# EAGLE design can-bus_trancseiver (EAGLE 7.6.0)
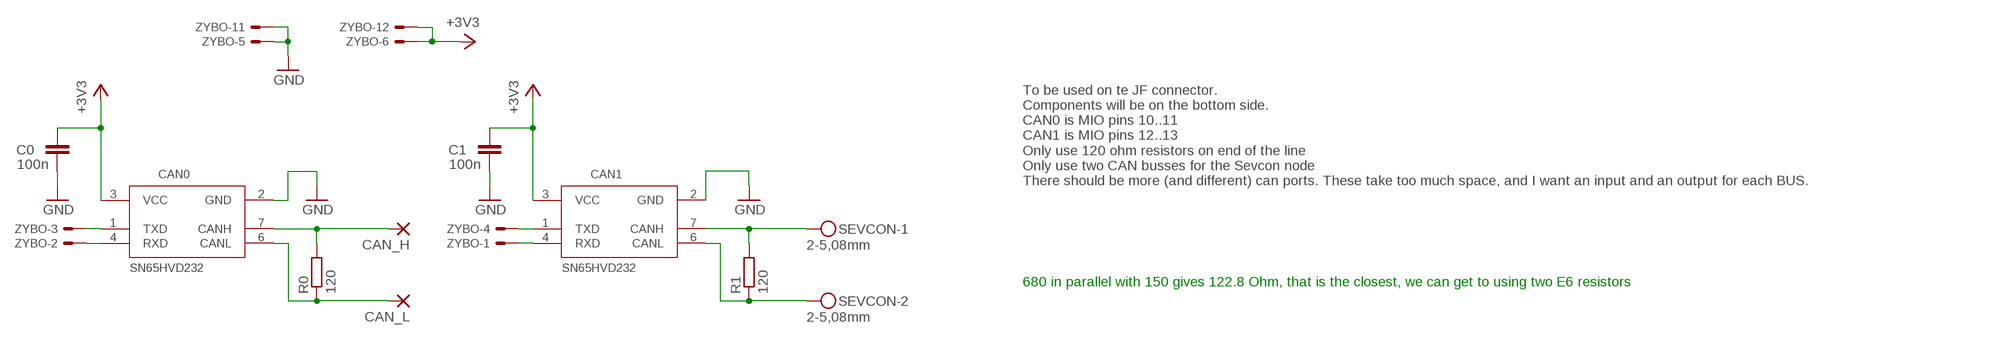
[diagram p0: schematic, sheet 1]

## Parts
C0  100n  C-EUC0805K  [C0805K]
C1  100n  C-EUC0805K  [C0805K]
CAN0  SN65HVD232  [SO08]
CAN1  SN65HVD232  [SO08]
CAN_H  1,6/0,8  [1,6/0,8]
CAN_L  1,6/0,8  [1,6/0,8]
R0  120  R-EU_R0805  [R0805]
R1  120  R-EU_R0805  [R0805]
SEVCON  2-5,08mm  MKDSN1,5/2-5,08  [MKDSN1,5/2-5,08]
ZYBO  PMOD12  [PMOD12]

## Nets
+3V3: C0.1 C1.1 CAN0.3(VCC) CAN1.3(VCC) ZYBO.6 ZYBO.12
GND: C0.2 C1.2 CAN0.2(GND) CAN1.2(GND) ZYBO.5 ZYBO.11
N$2: CAN0.1(TXD) ZYBO.3
N$3: CAN0.4(RXD) ZYBO.2
N$4: CAN1.1(TXD) ZYBO.4
N$5: CAN1.4(RXD) ZYBO.1
N$8 [CAN]: CAN0.7(CANH) CAN_H.1(P) R0.2
N$9 [CAN]: CAN1.7(CANH) R1.2 SEVCON.1
N$10 [CAN]: CAN1.6(CANL) R1.1 SEVCON.2
N$12 [CAN]: CAN0.6(CANL) CAN_L.1(P) R0.1
Unconnected: ZYBO.7 ZYBO.8 ZYBO.9 ZYBO.10

## Notes on the sheet
- To be used on te JF connector. 
  Components will be on the bottom side. 
  CAN0 is MIO pins 10..11
  CAN1 is MIO pins 12..13
  Only use 120 ohm resistors on end of the line
  Only use two CAN busses for the Sevcon node
  There should be more (and different) can ports. These take too much space, and I want an input and an output for each BUS.
- 680 in parallel with 150 gives 122.8 Ohm, that is the closest, we can get to using two E6 resistors

## Library data of the parts
C0 C1 = rcl:C-EU: CAPACITOR, European symbol
CAN0 CAN1 = 1_trancseiver:SN65HVD232: CAN TRANSCEIVER
CAN_H CAN_L = wirepad:1,6/0,8: THROUGH-HOLE PAD
R0 R1 = rcl:R-EU_: RESISTOR, European symbol
SEVCON = con-phoenix-508:MKDSN1,5/2-5,08: MKDSN 1,5/ 2-5,08 Printklemme Nennstrom: 13,5 A Nennspannung: 250 V Rastermaß: 5,08 mm Polzahl: 2 Anschlussart: Schraubanschluss Montage: Löten Anschlussrichtung Leiter/Platine: 0 ° Artikelnummer: 1729128 Source: http://eshop.phoenixcontact.com .. 1729128.pdf
ZYBO = PERSONAL:PMOD12

## Net classes
1 CAN: clearance 0.5 mm

## Board
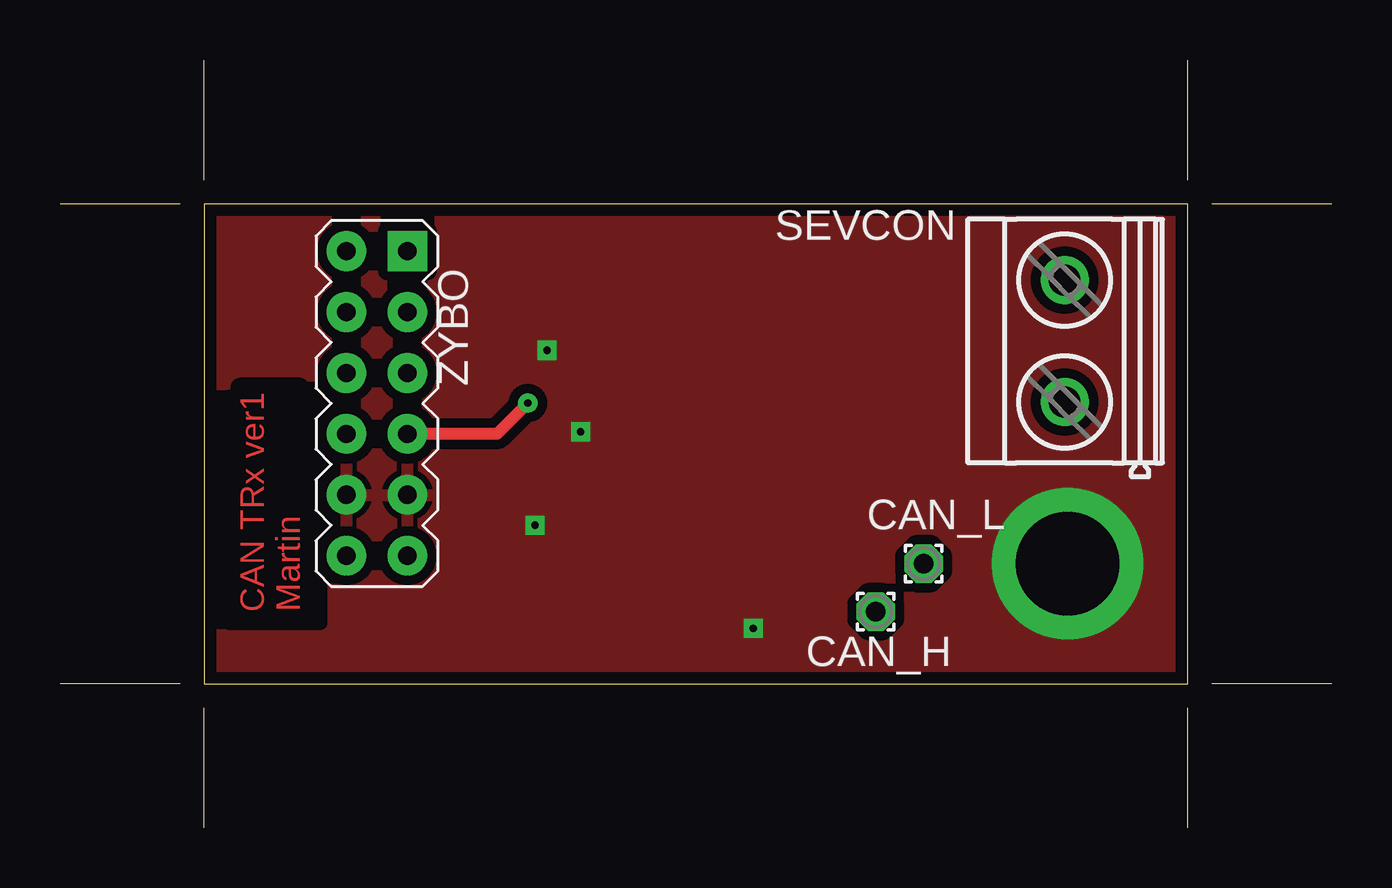
[diagram p1: board, top side]
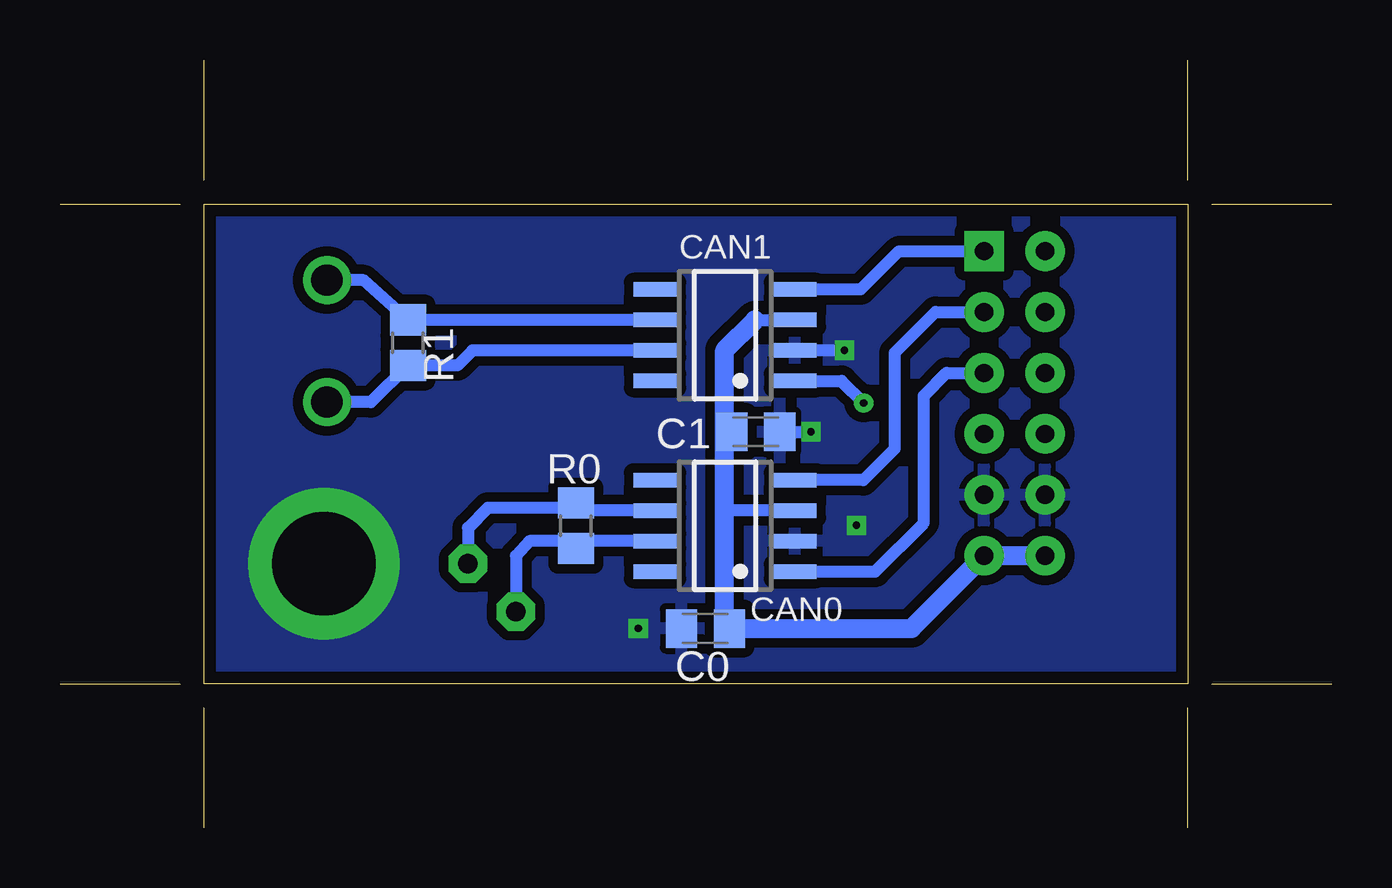
[diagram p2: board, bottom side, seen from below]

Size 53 x 32 mm. Coordinates in mm from the lower left corner, seen from the top.
Outline: 6,27 6,32
Outline: 5,26 0,26
Outline: 53,26 48,26
Outline: 53,6 48,6
Outline: 5,6 0,6
Outline: 47,27 47,32
Outline: 47,0 47,5
Outline: 6,0 6,5
Outline: 6,6 47,6 47,26 6,26 6,6
Copper layers (1*16): Top 0.035mm / dielectric 1.5mm / Bottom 0.035mm
Design rules "default *": minimum track width 0.4mm, minimum drill 0.3mm, track to track 0.4mm, track to pad 0.4mm, pad to pad 0.3mm, via to via 0.3mm, smd to smd 8mil, copper to edge 0.5mm, drill to drill 0.5mm, minimum pad ring 0.25mil, minimum via ring 0.25mm, stop-mask expansion 0.1mm, vias tented up to drill 5mm, thermal gap 0.25mm

### Footprints (pad centres in the part's own frame; a part is rotated, then mirrored left to right if it is on the bottom)
C0805K = smd 1.3 x 1.6: 1 -1,0; 2 1,0
SO08 = smd 0.6 x 1.8: 1 -1.905,-2.917; 2 -0.635,-2.917; 3 0.635,-2.917; 4 1.905,-2.917; 5 1.905,2.917; 6 0.635,2.917; 7 -0.635,2.917; 8 -1.905,2.917
1,6/0,8 = drill 0.813 pad 1.6 octagon: 1 0,0
R0805 = smd 1.3 x 1.5: 1 -0.95,0; 2 0.95,0
MKDSN1,5/2-5,08 = drill 1.3 pad 2: 1 -2.561,0.025; 2 2.519,0.025
PMOD12 = drill 0.762 pad 1.651 square: 1 -6.35,1.27 | drill 0.762 pad 1.651: 2 -3.81,1.27; 3 -1.27,1.27; 4 1.27,1.27; 5 3.81,1.27; 6 6.35,1.27; 7 -6.35,-1.27; 8 -3.81,-1.27; 9 -1.27,-1.27; 10 1.27,-1.27; 11 3.81,-1.27; 12 6.35,-1.27

### Placement (x,y rotation side)
C0  26.1,8.3 180 bottom
C1  24,16.5 0 bottom
CAN0  25.28,12.58 90 bottom
CAN1  25.28,20.53 90 bottom
CAN_H  34,9 0 top
CAN_L  36,11 0 top
R0  31.5,12.58 270 bottom
R1  38.5,20.21 270 bottom
SEVCON  41.9,20.3 90 top
ZYBO  13.21,17.68 270 top

### Tracks (layer width: path | path; a pad name or v marks a point on that pad's centre or on a via)
+3V3
  Bottom 0.5: 24.04,21.16 CAN1.3 | CAN0.3 25.3,13.21 | 25.3,8.55 C0.1 | C1.1 25.3,16.5
  Bottom 0.8: ZYBO.12 ZYBO.6 17.51,8.3 C0.1 | 25.3,8.55 25.3,13.21 25.3,16.5 25.3,19.9 24.04,21.16
GND  (via drill 0.3 pad 0.7, 4.3)
  Bottom 0.5: C1.2 v21.7,16.5 | v20.3,19.9 v20.3,19.89 CAN1.2
  other vias: 19.8,12.6 28.9,8.3 42,11
  pour Bottom: 6,6 47,6 47,26 6,26
  pour Top: 47,6 6,6 6,26 47,26
N$2
  Bottom 0.5: CAN0.1 19.02,10.68 17,12.7 17,18 16.05,18.95 ZYBO.3
N$3
  Bottom 0.5: CAN0.4 19.52,14.48 18.2,15.8 18.2,19.8 16.51,21.49 ZYBO.2
N$4  (via drill 0.3 pad 0.75)
  Top 0.5: v19.5,17.7 18.21,16.41 ZYBO.4
  Bottom 0.5: CAN1.1 20.43,18.62 v19.5,17.7
N$5
  Bottom 0.5: CAN1.4 19.63,22.43 18.03,24.03 ZYBO.1
N$6
  cutout Top: 7.1,8.5 10.9,8.5 10.9,18 7,18 7,8.5 7.2,8.5
N$8
  Bottom 0.5: CAN0.7 31.18,11.95 R0.2 31.48,11.95 33.43,11.95 34,11.33 CAN_H.1
N$9
  Bottom 0.5: 38.28,19.49 R1.2 | R1.2 40.04,17.74 SEVCON.1 | CAN1.7 35.8,19.89 36.44,19.27 R1.2
N$10
  Bottom 0.5: 38.28,20.77 R1.1 | R1.1 40.34,22.82 SEVCON.2 | CAN1.6 R1.1
N$12
  Bottom 0.5: CAN0.6 31.29,13.21 R0.1 31.7,13.33 35.17,13.33 36,12.5 CAN_L.1

### Text on the board
Top: CAN TRx ver1 / Martin